# Altium project ePBR20_ACC_HVB.PrjPcb
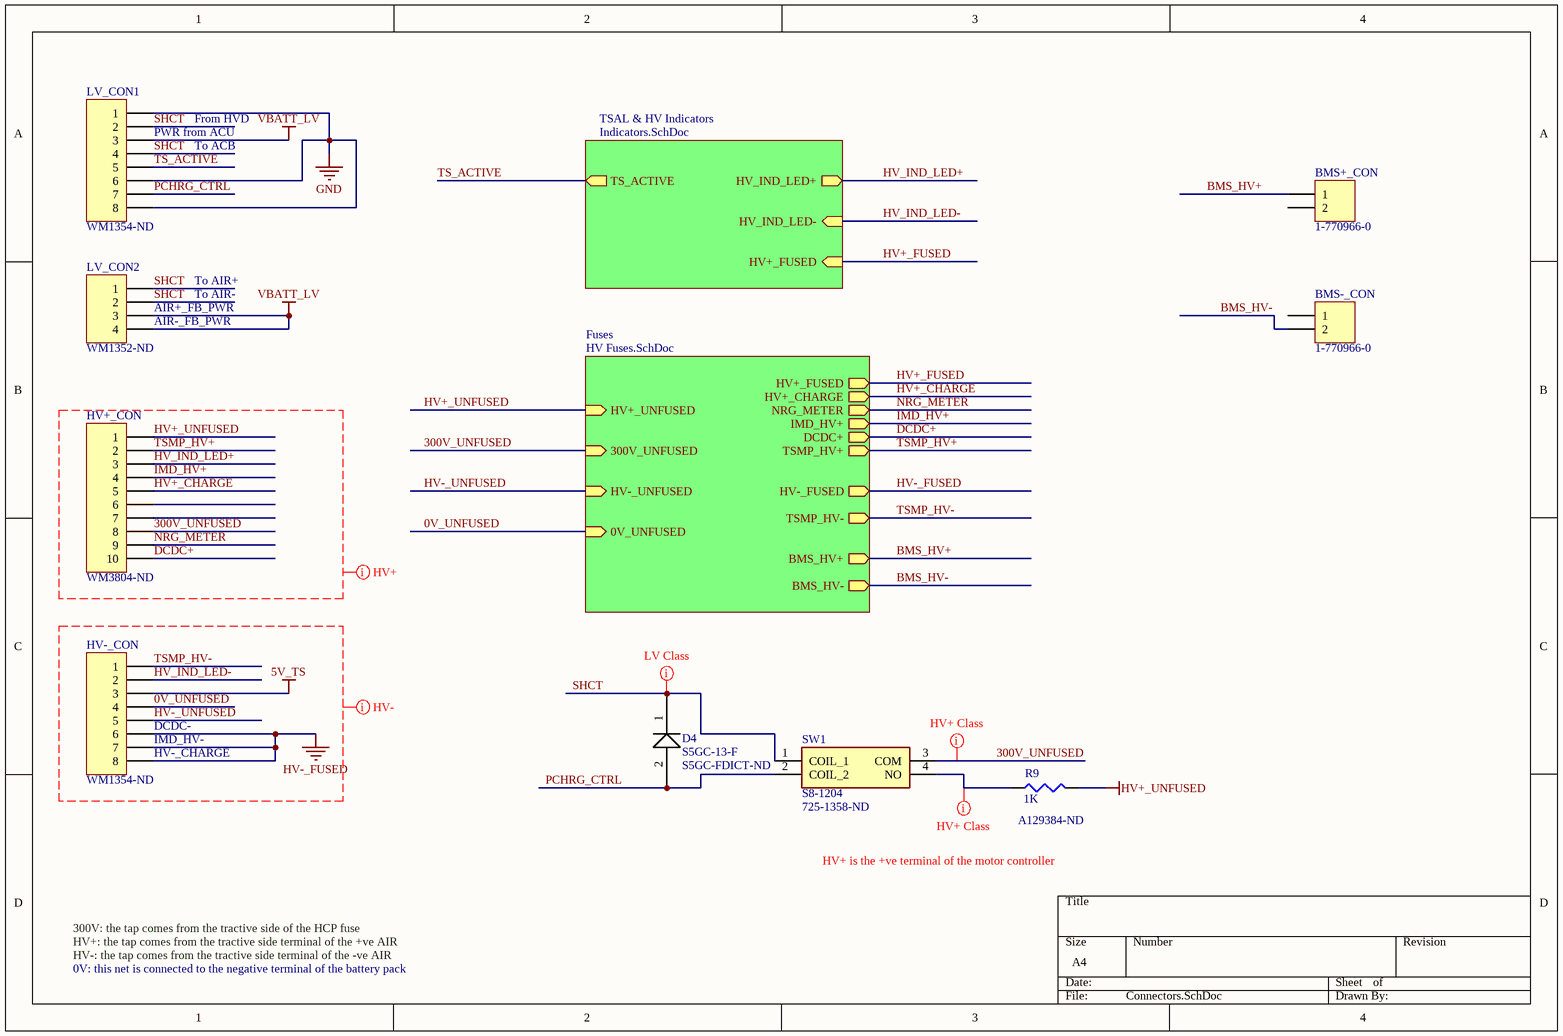
[diagram p0: Connectors.SchDoc]
3 sheets, 40 parts. Net scope: hierarchical (ports join the sheet entries above them; power ports are global).
Board file: ePBR20_HVB_rev1.PcbDoc
Sheets:
  Connectors.SchDoc
    TSAL & HV Indicators = Indicators.SchDoc
    Fuses = HV Fuses.SchDoc

## Sheet Connectors.SchDoc
size A4

### Parts
BMS+_CON  1-770966-0  [TE  1-770966-0 2POS CONN]
BMS-_CON  1-770966-0  [TE  1-770966-0 2POS CONN]
D4  S5GC-13-F  Supplier Part Number 1: S5GC-FDICT-ND  [DO-214AB]
HV+_CON  (no value)  [WM3804-ND]
HV-_CON  Supplier Part Number 1: WM1354-ND  [WM3846-ND]  (hidden comment: Header 8)
LV_CON1  Supplier Part Number 1: WM1354-ND  [WM3846-ND]  (hidden comment: Header 8)
LV_CON2  Supplier Part Number 1: WM1352-ND  [WM3801-ND]  (hidden comment: Header 4)
R9  1K  Supplier Part Number 1: A129384-ND  [AXIAL RESISTOR WW 14W]
SW1  S8-1204  Supplier Part Number 1: 725-1358-ND  [S80504VU]

### Sub-sheets
Fuses = HV Fuses.SchDoc: HV+_UNFUSED (in), 300V_UNFUSED (in), HV+_CHARGE (out), NRG_METER (out), IMD_HV+ (out), BMS_HV+ (out), BMS_HV- (out), HV-_UNFUSED (in), 0V_UNFUSED (in), HV+_FUSED (out), DCDC+ (out), TSMP_HV+ (out), HV-_FUSED (out), TSMP_HV- (out)
TSAL & HV Indicators = Indicators.SchDoc: HV_IND_LED+ (out), TS_ACTIVE (out), HV_IND_LED- (in), HV+_FUSED (in)

### Nets
5V_TS: HV-_CON.3
GND: LV_CON1.1 LV_CON1.6 LV_CON1.8
HV+_UNFUSED: HV+_CON.1 R9.2 ; sheet Fuses/HV+_UNFUSED  [project net HV+]
HV-_FUSED: HV-_CON.6 HV-_CON.7 HV-_CON.8 ; sheet Fuses/HV-_FUSED
VBATT_LV: LV_CON1.3 LV_CON2.3 LV_CON2.4
0V_UNFUSED: HV-_CON.4 ; sheet Fuses/0V_UNFUSED
300V_UNFUSED: HV+_CON.8 SW1.3(COM) ; sheet Fuses/300V_UNFUSED
BMS_HV+: BMS+_CON.1 ; sheet Fuses/BMS_HV+
BMS_HV-: BMS-_CON.2 ; sheet Fuses/BMS_HV-
DCDC+: HV+_CON.10 ; sheet Fuses/DCDC+
HV+_CHARGE: HV+_CON.5 ; sheet Fuses/HV+_CHARGE
HV+_FUSED: sheet TSAL & HV Indicators/HV+_FUSED, sheet Fuses/HV+_FUSED
HV-_UNFUSED: HV-_CON.5 ; sheet Fuses/HV-_UNFUSED  [project net HV-]
HV_IND_LED+: HV+_CON.3 ; sheet TSAL & HV Indicators/HV_IND_LED+
HV_IND_LED-: HV-_CON.2 ; sheet TSAL & HV Indicators/HV_IND_LED-
IMD_HV+: HV+_CON.4 ; sheet Fuses/IMD_HV+
NRG_METER: HV+_CON.9 ; sheet Fuses/NRG_METER
PCHRG_CTRL: D4.2 LV_CON1.7 SW1.2(COIL_2)
SHCT: D4.1 LV_CON1.2 LV_CON1.4 LV_CON2.1 LV_CON2.2 SW1.1(COIL_1)
TS_ACTIVE: LV_CON1.5 ; sheet TSAL & HV Indicators/TS_ACTIVE
TSMP_HV+: HV+_CON.2 ; sheet Fuses/TSMP_HV+
TSMP_HV-: HV-_CON.1 ; sheet Fuses/TSMP_HV-
NetR9_1: R9.1 SW1.4(NO)

Not connected (* = marked no-connect by the designer): BMS+_CON 2; BMS-_CON 1; HV+_CON 6 7

### Layout directives
mark named HV-: 0V_UNFUSED, 5V_TS, HV-_FUSED, HV-_UNFUSED, HV_IND_LED-, TSMP_HV-
mark named HV+: 300V_UNFUSED, DCDC+, HV+_CHARGE, HV+_UNFUSED, HV_IND_LED+, IMD_HV+, NRG_METER, TSMP_HV+
net class HV+ Class: 300V_UNFUSED, NetR9_1
net class LV Class: SHCT

### Notes on the sheet
- (near LV_CON1) PWR from ACU
- From HVD
- To ACB
- (near LV_CON2) AIR+_FB_PWR
- To AIR+
- To AIR-
- (near LV_CON2) AIR-_FB_PWR
- (near HV-_CON) DCDC-
- (near HV-_CON) IMD_HV-
- (near HV-_CON) HV-_CHARGE
- HV+ is the +ve terminal of the motor controller
- 300V: the tap comes from the tractive side of the HCP fuse
- HV+: the tap comes from the tractive side terminal of the +ve AIR
- HV-: the tap comes from the tractive side terminal of the -ve AIR
- 0V: this net is connected to the negative terminal of the battery pack

### Library data of the parts
BMS+_CON BMS-_CON = Header 2: Header, 2-Pin; LatestRevisionDate: 17-Jul-2002; LatestRevisionNote: Re-released for DXP Platform.; Publisher: Altium Limited
D4 = DIODE 1N4001: DIODE GEN PURP 400V 5A SMC; Supplier 1: Digi-Key
HV+_CON = Header 10: WM3804-ND; LatestRevisionDate: 17-Jul-2002; LatestRevisionNote: Re-released for DXP Platform.; Publisher: Altium Limited; Supplier 1: Digi-Key; Supplier Part Number 1: WM3804-ND
HV-_CON LV_CON1 = Header 8: Header, 8-Pin; LatestRevisionDate: 17-Jul-2002; LatestRevisionNote: Re-released for DXP Platform.; Publisher: Altium Limited; Supplier 1: Digi-Key
LV_CON2 = Header 4: Header, 4-Pin; LatestRevisionDate: 17-Jul-2002; LatestRevisionNote: Re-released for DXP Platform.; Publisher: Altium Limited; Supplier 1: Digi-Key
R9 = Res3: 20J1K0E: RES 1K OHM 10W 5% AXIAL; Published: 8-Jun-2000; LatestRevisionDate: 29-May-2009; LatestRevisionNote: IPC-7351 Footprint Added.; PackageReference: J1-0603; Publisher: Altium Limited; PackageDescription: Chip Resistor; Supplier 1: Digi-Key
SW1 = S8-1204V_RS: Relay or Contactor; Manufacturer_Name: Cynergy3; Manufacturer_Part_Number: S8-1204V/RS; Datasheet Link: http://uk.rs-online.com/web/p/products/1245064; Height: 12mm; RS Part Number: 1245064; RS Price/Stock: http://uk.rs-online.com/web/p/products/1245064; Supplier 1: Digi-Key

## Sheet Indicators.SchDoc
size A4
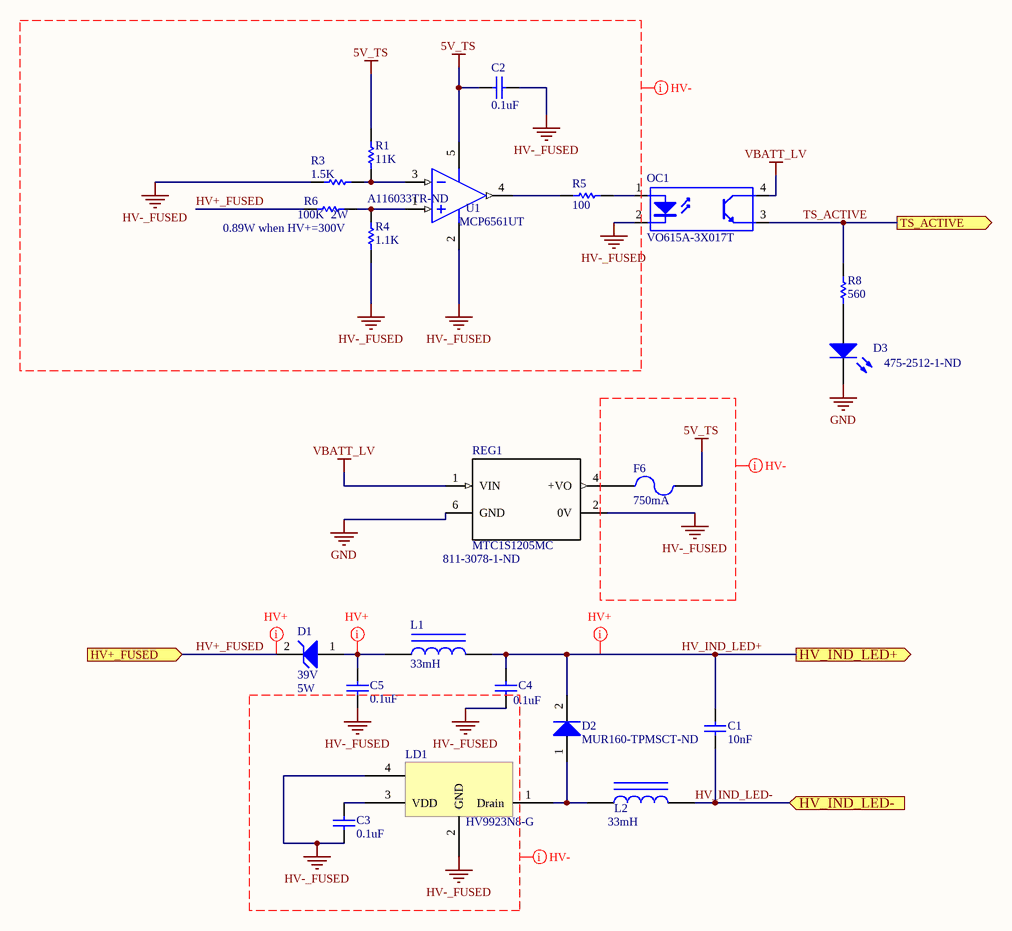
[diagram p1: Indicators.SchDoc]

### Parts
C1  10nF  [0805R-GENERIC]
C2  0.1uF  [1206R-GENERIC]
C3  0.1uF  [1206R-GENERIC]
C4  0.1uF  [1206R-GENERIC]
C5  0.1uF  [1206R-GENERIC]
D1  Voltage: 39V  Power: 5W  [DO-214AA]  (hidden comment: SMBJ5366B-TP)
D2  MUR160-TPMSCT-ND  [DO-41]
D3  SupplierPartNo: 475-2512-1-ND  [J1-0603]
F6  750mA  [FUSEHOLDER 5X20]
L1  33mH  [Radial - 3mm]
L2  33mH  [Radial - 3mm]
LD1  HV9923N8-G  [TO-243AA]
OC1  VO615A-3X017T  [Optocoupler]
R1  11K  [1206R-GENERIC]
R3  1.5K  [1206R-GENERIC]
R4  Supplier Part Number 2: A116033TR-ND  [1206R-GENERIC]  (hidden comment: 1.1K)
R5  100  [1206R-GENERIC]
R6  Power: 2W  [RESC2512(6432)_N]  (hidden comment: 100K)
R8  560  [J1-0603]
REG1  MTC1S1205MC  SupplierPartNo: 811-3078-1-ND  [MTC1S1205MC]
U1  MCP6561UT  [SOT-23-OT5_N]

### Ports
HV+_FUSED (in), HV_IND_LED+ (out), HV_IND_LED- (in), TS_ACTIVE (out)

### Nets
5V_TS: C2.2 F6.1 R1.1 U1.5(VDD)
GND: D3.2(K) REG1.6(GND)
HV-_FUSED: C2.1 C3.1 C4.1 C5.2 LD1.2(GND) LD1.4 OC1.2(K) R3.1 R4.2 REG1.2(0V) U1.2(VSS)
VBATT_LV: OC1.4(C) REG1.1(VIN)
HV+_FUSED: D1.2(K) R6.2 ; port HV+_FUSED
HV_IND_LED+: C1.2 C4.2 D2.2(K) L1.2 ; port HV_IND_LED+
HV_IND_LED-: C1.1 L2.2 ; port HV_IND_LED-
TS_ACTIVE: OC1.3(E) R8.2 ; port TS_ACTIVE
NetC3_2: C3.2 LD1.3(VDD)
NetC5_1: C5.1 D1.1(A) L1.1
NetD2_1: D2.1(A) L2.1 LD1.1(Drain)
NetD3_1: D3.1(A) R8.1
NetF6_2: F6.2 REG1.4(+VO)
NetOC1_1: OC1.1(A) R5.2
NetR1_2: R1.2 R3.2 U1.3(VIN-)
NetR4_1: R4.1 R6.1 U1.1(VIN+)
NetR5_1: R5.1 U1.4(OUT)

### Layout directives
mark named HV-: 5V_TS, HV+_FUSED, HV-_FUSED
mark named HV+: HV+_FUSED, HV_IND_LED+, NetC5_1

### Notes on the sheet
- (near R6) 0.89W when HV+=300V

### Library data of the parts
C1 = Cap: 885342207014:  CAP CER 10000PF 500V X7R 0805; Published: 8-Jun-2000; LatestRevisionDate: 17-Jul-2002; LatestRevisionNote: Re-released for DXP Platform.; PackageReference: RAD-0.3; Publisher: Altium Limited; PackageDescription: Radial Cap, Thru-Hole; 2 Leads; 0.3 in Pin Spacing; Value: 10nF; Supplier 1: Digi-Key; Supplier Part Number 1: 732-12169-1-ND
C2-C5 = Cap: CGA5L4X7T2W104M160AA: CAP CER 0.1UF 450V X7T 1206; Published: 8-Jun-2000; LatestRevisionDate: 17-Jul-2002; LatestRevisionNote: Re-released for DXP Platform.; PackageReference: RAD-0.3; Publisher: Altium Limited; PackageDescription: Radial Cap, Thru-Hole; 2 Leads; 0.3 in Pin Spacing; Value: 0.1uF; Supplier 1: Digi-Key; Supplier Part Number 1: 445-12959-1-ND
D1 = D Zener: DIODE ZENER 39V 5W DO214AA; Published: 8-Jun-2000; LatestRevisionDate: 17-Jul-2002; LatestRevisionNote: Re-released for DXP Platform.; PackageReference: DIODE-0.7; Publisher: Altium Limited; PackageDescription: Diode, Thru-Hole; 2 Leads; 0.7 in Pin Spacing; Supplier 1: Digi-Key; Supplier Part Number 1: SMBJ5366B-TPMSCT-ND
D2 = Diode 1N914: DIODE GEN PURP 600V 1A DO41; Published: 8-Jun-2000; LatestRevisionDate: 17-Jul-2002; LatestRevisionNote: Re-released for DXP Platform.; DatasheetVersion: 1997; PackageReference: DO-35; Publisher: Altium Limited; PackageDescription: Diode, Axial; Body 3.8 x 1.9 mm (LxDia. max), Lead Dia. 0.53 mm (max); Code_JEDEC: DO-204-AH; ComponentLink1Description: Manufacturer Link; ComponentLink1URL: http://www.fairchildsemi.com/; ComponentLink2Description: Datasheet; ComponentLink2URL: http://www.fairchildsemi.com/ds/1N%2F1N4448.pdf; Supplier 1: Digi-Key; Supplier Part Number 1: MUR160-TPMSCT-ND
D3 = LED2: Typical RED, GREEN, YELLOW, AMBER GaAs LED; Published: 8-Jun-2000; LatestRevisionDate: 17-Jul-2002; LatestRevisionNote: Re-released for DXP Platform.; PackageVersion: Feb-2002; PackageReference: 3.2X1.6X1.1; Publisher: Altium Limited; PackageDescription: SM LED; 2 Flat Leads
F6 = Fuse 2: 0031.8201: FUSE BLOK CARTRIDGE 500V 10A PCB; Published: 8-Jun-2000; LatestRevisionDate: 17-Jul-2002; LatestRevisionNote: Re-released for DXP Platform.; PackageReference: PIN-W2/E2.8; Publisher: Altium Limited; PackageDescription: Thru-Hole; 2 Leads; Supplier 2: Digi-Key; Supplier Part Number 2: 486-1258-ND
L1 L2 = Inductor Iron: 22R336C: FIXED IND 33MH 36MA 118.8 OHM TH; Published: 24-Mar-1999; LatestRevisionDate: 17-Jul-2002; LatestRevisionNote: Re-released for DXP Platform.; PackageReference: AXIAL-0.9; Publisher: Altium Limited; PackageDescription: Axial Device, Thru-Hole; 2 Leads; 0.9 in Pin Spacing; Value: 33mH; Supplier 1: Digi-Key; Supplier Part Number 1: 811-1294-ND
LD1 = 1-776163-5: IC LED Driver AC DC Offline Switcher Triac Dimming 30mA Lighting SOT-89-3; Supplier 1: Digi-Key; Supplier Part Number 1: HV9923N8-GCT-ND; ComponentLink1Description: Datasheet; ComponentLink1URL: http://ww1.microchip.com/downloads/en/DeviceDoc/20005311A.pdf
OC1 = Optoisolator1: OPTOISOLATR 5KV TRANSISTOR 4-SMD; Published: 24-Mar-1999; LatestRevisionDate: 04-Mar-2005; LatestRevisionNote: Sch pins 3 & 4 Swapped.; DatasheetVersion: Nov-2003; PackageReference: DIP-4; Publisher: Altium Limited; Supplier 1: Digi-Key; Supplier Part Number 1: VO615A-3X017TCT-ND; ComponentLink1Description: Datasheet; ComponentLink1URL: http://www.vishay.com/docs/81753/vo615a.pdf
R1 = Res1: KTR18EZPF1102: RES SMD 11K OHM 1% 1/4W 1206; Published: 8-Jun-2000; LatestRevisionDate: 17-Jul-2002; LatestRevisionNote: Re-released for DXP Platform.; PackageReference: AXIAL-0.3; Publisher: Altium Limited; PackageDescription: Axial Device, Thru-Hole; 2 Leads; 0.3 in Pin Spacing; Value: 11K; Supplier 1: Digi-Key; Supplier Part Number 1: RHM11KAICT-ND
R3 = Res1: KTR18EZPF1501: RES SMD 1.5K OHM 1% 1/4W 1206; Published: 8-Jun-2000; LatestRevisionDate: 17-Jul-2002; LatestRevisionNote: Re-released for DXP Platform.; PackageReference: AXIAL-0.3; Publisher: Altium Limited; PackageDescription: Axial Device, Thru-Hole; 2 Leads; 0.3 in Pin Spacing; Value: 1.5K; Supplier 1: Digi-Key; Supplier Part Number 1: RHM1.50KAICT-ND
R4 = Res1: RT1210BRD071K1L: RES SMD 1.1K OHM 0.1% 1/4W 1210; Published: 8-Jun-2000; LatestRevisionDate: 17-Jul-2002; LatestRevisionNote: Re-released for DXP Platform.; PackageReference: AXIAL-0.3; Publisher: Altium Limited; PackageDescription: Axial Device, Thru-Hole; 2 Leads; 0.3 in Pin Spacing; Value: 1.1K; Supplier 1: Digi-Key; Supplier Part Number 1: YAG2209CT-ND; Supplier 2: Digi-Key
R5 R8 = Res1: KTR18EZPJ101: RES SMD 100 OHM 5% 1/4W 1206; Published: 8-Jun-2000; LatestRevisionDate: 17-Jul-2002; LatestRevisionNote: Re-released for DXP Platform.; PackageReference: AXIAL-0.3; Publisher: Altium Limited; PackageDescription: Axial Device, Thru-Hole; 2 Leads; 0.3 in Pin Spacing; Supplier 1: Digi-Key; Supplier Part Number 1: RHM100PCT-ND
  R5: Value: 100
  R8: Value: 560
R6 = CMP-1018-00122-1: HVCB2512FKC100K: RES SMD 100K OHM 1% 2W 2512; Case-Metric: 6432; Tolerance: 5 %; Case-EIA: 2512; Value: 100K; Technology: SMT; Supplier 1: Digi-Key; Supplier Part Number 1: HVCB2512FKC100KCT-ND
U1 = CMP-0187-00428-2: 1.8V Low Power Push-Pull Output Comparator, 5-Pin SOT-23, Extended Temperature Range, Tape and Reel; RevisionNote: URLs added.; ComponentLink1URL: http://www.microchip.com/; DatasheetVersion: revB, Aug-2009; ComponentLink3Description: Package Specification; ComponentLink2Description: Datasheet; PackageDescription: 5-Lead Plastic Small Outline Transistor (OT) [SOT-23]; PackageVersion: revBB, Aug-2009; PackageReference: SOT-23-OT5; ComponentLink2URL: http://ww1.microchip.com/downloads/en/DeviceDoc/22139b.pdf; Code_IPC: SOT23-5; ComponentLink1Description: Manufacturer URL; ComponentLink3URL: http://www.microchip.com/stellent/groups/techpub_sg/documents/packagingspec/en012702.pdf; Supplier 1: Digi-Key; Supplier Part Number 1: MCP6561UT-E/OTCT-ND; Supplier 2: Digi-Key; Supplier Part Number 2: MCP6561UT-E/OTDKR-ND
REG1 = MTC1S1205MC: Value: *

## Sheet HV Fuses.SchDoc
size A4
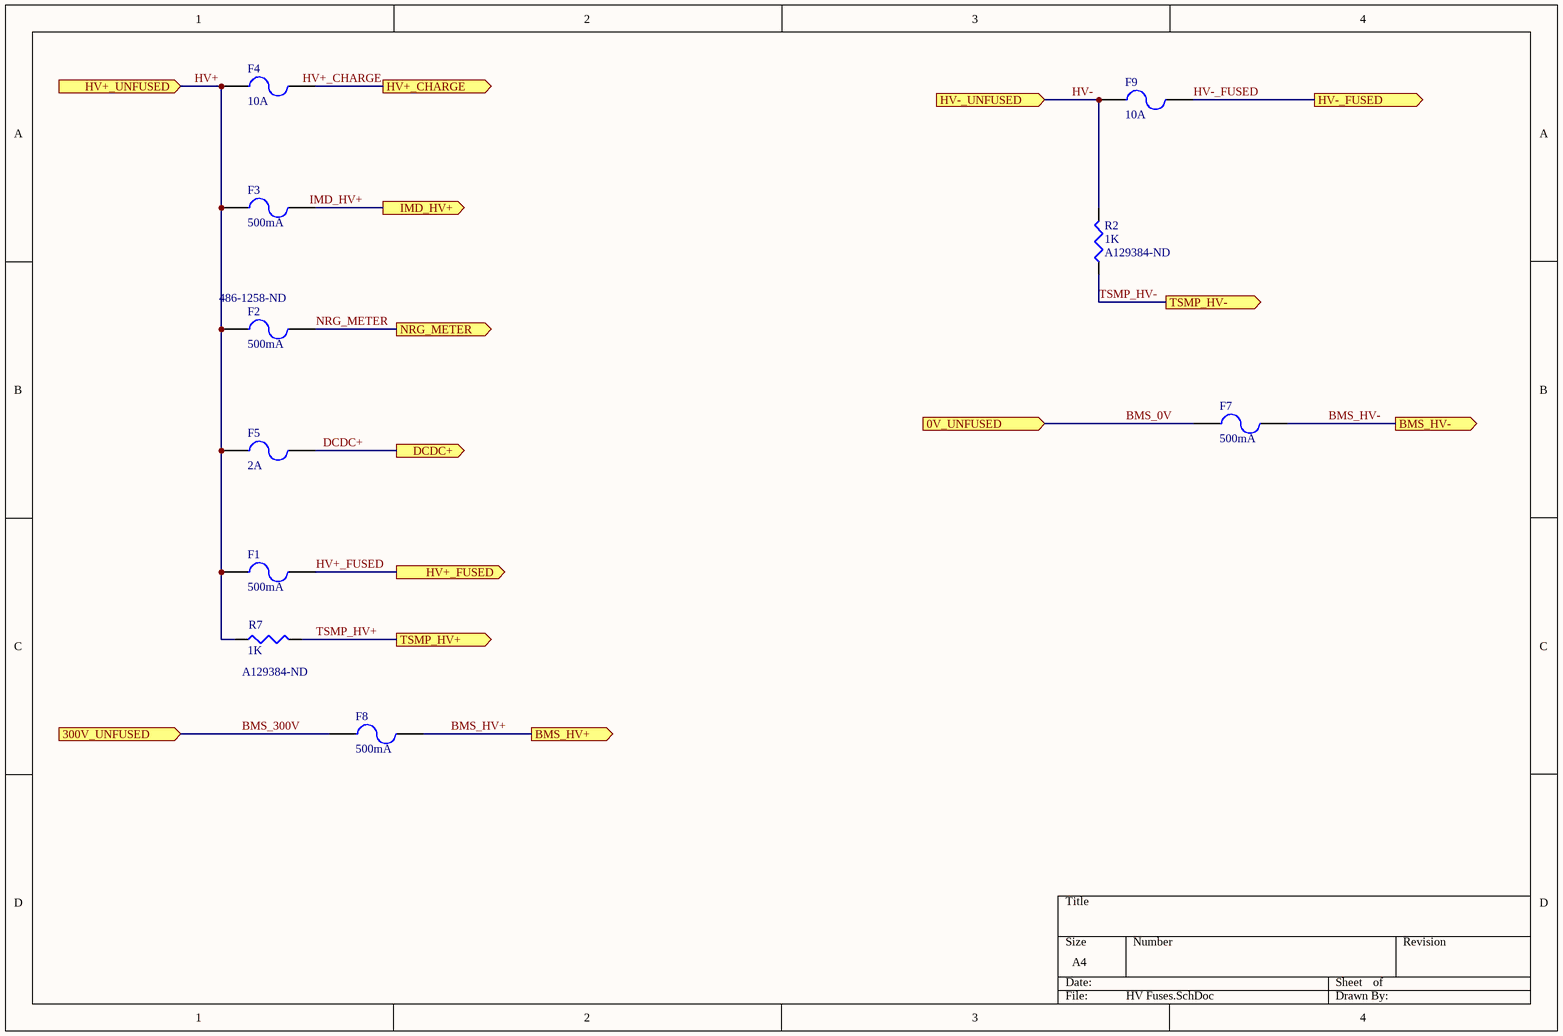
[diagram p2: HV Fuses.SchDoc]

### Parts
F1  500mA  [FUSEHOLDER 5X20]
F2  500mA  Supplier Part Number 1: 486-1258-ND  [FUSEHOLDER 5X20]
F3  500mA  [FUSEHOLDER 5X20]
F4  10A  [FUSEHOLDER 5X20]
F5  2A  [FUSEHOLDER 5X20]
F7  500mA  [FUSEHOLDER 5X20]
F8  500mA  [FUSEHOLDER 5X20]
F9  10A  [FUSEHOLDER 5X20]
R2  1K  Supplier Part Number 1: A129384-ND  [AXIAL RESISTOR WW 14W]
R7  1K  Supplier Part Number 1: A129384-ND  [AXIAL RESISTOR WW 14W]

### Ports
0V_UNFUSED (in), 300V_UNFUSED (in), BMS_HV+ (out), BMS_HV- (out), DCDC+ (out), HV+_CHARGE (out), HV+_FUSED (out), HV+_UNFUSED (in), HV-_FUSED (out), HV-_UNFUSED (in), IMD_HV+ (out), NRG_METER (out), TSMP_HV+ (out), TSMP_HV- (out)

### Nets
HV+: F1.2 F2.2 F3.2 F4.2 F5.2 R7.1 ; port HV+_UNFUSED
HV-_FUSED: F9.1 ; port HV-_FUSED
BMS_0V: F7.2 ; port 0V_UNFUSED  [project net 0V_UNFUSED]
BMS_300V: F8.2 ; port 300V_UNFUSED  [project net 300V_UNFUSED]
BMS_HV+: F8.1 ; port BMS_HV+
BMS_HV-: F7.1 ; port BMS_HV-
DCDC+: F5.1 ; port DCDC+
HV+_CHARGE: F4.1 ; port HV+_CHARGE
HV+_FUSED: F1.1 ; port HV+_FUSED
HV-: F9.2 R2.2 ; port HV-_UNFUSED
IMD_HV+: F3.1 ; port IMD_HV+
NRG_METER: F2.1 ; port NRG_METER
TSMP_HV+: R7.2 ; port TSMP_HV+
TSMP_HV-: R2.1 ; port TSMP_HV-

### Notes on the sheet
- Labels drawn without touching a wire or pin: HV+_CHARGE, IMD_HV+

### Library data of the parts
F1-F5 F7-F9 = Fuse 2: as F6 on sheet Indicators; Published: 8-Jun-2000; LatestRevisionDate: 17-Jul-2002; LatestRevisionNote: Re-released for DXP Platform.; PackageReference: PIN-W2/E2.8; Publisher: Altium Limited; PackageDescription: Thru-Hole; 2 Leads
  F2: Supplier 1: Digi-Key
  F3: Supplier 1: Digi-Key; Supplier Part Number 1: 486-1258-ND
  F4: Supplier Part Number 1: 486-1258-ND; Supplier 1: Digi-Key
  F9: Supplier Part Number 1: *
R2 R7 = Res3: 20J1K0E: RES 1K OHM 10W 5% AXIAL; Published: 8-Jun-2000; LatestRevisionDate: 29-May-2009; LatestRevisionNote: IPC-7351 Footprint Added.; PackageReference: J1-0603; Publisher: Altium Limited; PackageDescription: Chip Resistor; Supplier 1: Digi-Key

## Nets that join several sheets
5V_TS: Connectors (HV-_CON.3), Indicators (C2.2 F6.1 R1.1 U1.5)
GND: Connectors (LV_CON1.1 LV_CON1.6 LV_CON1.8), Indicators (D3.2 REG1.6)
HV+: Connectors (HV+_CON.1 R9.2), HV Fuses (6 pins)
HV-_FUSED: Connectors (HV-_CON.6 HV-_CON.7 HV-_CON.8), Indicators (11 pins), HV Fuses (F9.1)
VBATT_LV: Connectors (LV_CON1.3 LV_CON2.3 LV_CON2.4), Indicators (OC1.4 REG1.1)
0V_UNFUSED: Connectors (HV-_CON.4), HV Fuses (F7.2)
300V_UNFUSED: Connectors (HV+_CON.8 SW1.3), HV Fuses (F8.2)
BMS_HV+: Connectors (BMS+_CON.1), HV Fuses (F8.1)
BMS_HV-: Connectors (BMS-_CON.2), HV Fuses (F7.1)
DCDC+: Connectors (HV+_CON.10), HV Fuses (F5.1)
HV+_CHARGE: Connectors (HV+_CON.5), HV Fuses (F4.1)
HV+_FUSED: Indicators (D1.2 R6.2), HV Fuses (F1.1)
HV-: Connectors (HV-_CON.5), HV Fuses (F9.2 R2.2)
HV_IND_LED+: Connectors (HV+_CON.3), Indicators (C1.2 C4.2 D2.2 L1.2)
HV_IND_LED-: Connectors (HV-_CON.2), Indicators (C1.1 L2.2)
IMD_HV+: Connectors (HV+_CON.4), HV Fuses (F3.1)
NRG_METER: Connectors (HV+_CON.9), HV Fuses (F2.1)
TS_ACTIVE: Connectors (LV_CON1.5), Indicators (OC1.3 R8.2)
TSMP_HV+: Connectors (HV+_CON.2), HV Fuses (R7.2)
TSMP_HV-: Connectors (HV-_CON.1), HV Fuses (R2.1)